# Altium schematic sheet Autoprog.SchDoc
size A4; SheetNumber: 2; SheetTotal: 2
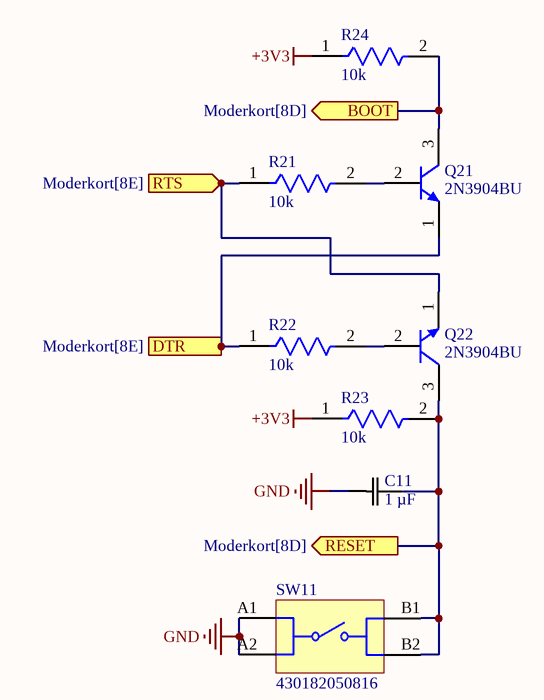
[diagram p0: Autoprog.SchDoc]

## Parts
C11  1 µF  [1 µF]
Q21  2N3904BU  [FAIR-TO-92]
Q22  2N3904BU  [FAIR-TO-92]
R21  value 10k  [FP-RT1206-IPC_C]  (hidden comment: RT1206BRD07470RL)
R22  value 10k  [FP-RT1206-IPC_C]  (hidden comment: RT1206BRD07470RL)
R23  value 10k  [FP-RT1206-IPC_C]  (hidden comment: RT1206BRD07470RL)
R24  value 10k  [FP-RT1206-IPC_C]  (hidden comment: RT1206BRD07470RL)
SW11  430182050816  [430182050816]

## Ports
BOOT (out, see Moderkort[8D]), DTR (in, see Moderkort[8E]), RESET (out, see Moderkort[8D]), RTS (in, see Moderkort[8E])

## Nets
+3V3: R23.1 R24.1
GND: C11.1 SW11.A1 SW11.A2
BOOT: Q21.3(C) R24.2 ; port BOOT
DTR: Q21.1(E) R22.1 ; port DTR
RESET: C11.2 Q22.3(C) R23.2 SW11.B1 SW11.B2 ; port RESET
RTS: Q22.1(E) R21.1 ; port RTS
NetQ21_2: Q21.2(B) R21.2
NetQ22_2: Q22.2(B) R22.2

## Library data of the parts
C11 = CMP-001-00197-1: SMD Auto X7R Flex, Ceramic, 1 uF, 20%, 25 VDC, X7R, SMD, MLCC, FT-CAP, Automotive Grade, 1206; Manufacturer_Name: Kemet; Manufacturer_Part_Number: C1206X105M3RACAUTO; Pins: 2; Copyright: Copyright (C) 2025 Ultra Librarian. All rights reserved.; Component Type: Standard; Design Item ID: 1 µF; Source: 1MicroF.SchLib
Q21 Q22 = CMP-2000-04944-1: NPN General-Purpose Amplifier, 40 V VCEO, 0.2 A, -55 to 150 degC, 2-Pin TO-92, RoHS, Bulk; Manufacturer: FairchildSemiconductor; Maximum Collector Base Voltage: 60V; Minimum DC Current Gain: 40@0.1mA@1V; Maximum Collector Emitter Voltage: 40V; Maximum DC Collector Current: 0.2A; Rad Hard: No; Maximum Operating Frequency: 300(Min)MHz; Maximum Collector Emitter Saturation Voltage: 0.2@1mA@10mA; Maximum Power Dissipation: 625mW; Package Description: 3-Pin Transistor Outline Package, Body Dia 4.79 mm, Pitch 1.27 mm; Package Reference: TO-92; Pin Count: 3; Operating Temperature: -55to150degC; Category: GPBJT; Manufacturer URL: https://www.fairchildsemi.com/; Datasheet URL: https://datasheet.ciiva.com/4722/2n3904-82270-4722369.pdf; Package: 3TO-92; Packaging: Bulk; Type: NPN; Datasheet Version: Rev. 1.1.0, 10/2014; Mounting: ThroughHole
R21-R24 = CMP-009-00218-1: Fixed Resistor, Thin Film, 0.25W, 470ohm, 200V, 0.1% +/-Tol, 25ppm/Cel, Surface Mount, 1206; Power: 250mW; Additional Feature: HIGH PRECISION; Rated Temperature: 70°C; Package Width: 1.6mm; Temperature Coefficient (ppm/Cel): 25; Package Length: 3.1mm; Package Height: 0.55mm; Construction: Chip; Termination: Wraparound; Pins: 2; Case/Package: 1206; Resistor Type: FIXED RESISTOR; Reach SVHC Compliant: Yes; Tolerance: 0.1%; Technology: THIN FILM; Mounting Technology: Surface Mount; Packaging: Tape and Reel; RoHS Compliant: Yes; Working Voltage: 200V; Min Operating Temperature: -55°C; Max Operating Temperature: 155°C
SW11 = CMP-1452-00014-10: Switch Tactile N.O. SPST Round Button Gull Wing 0.05A 12VDC 1000000Cycles 1.57N SMD Reel; Life (Cycles): 1Mcycles; Contact Resistance: 100mΩ; Actuator Length: 1.6mm; Switch Function: Off-Mom; Illumination Type: Illuminated, Non-Illuminated; Voltage Rating: 12V; Current Rating: 50mA; Switch Travel: 250µm; Actuator Material: Liquid Crystal Polymer, Polymer; Min Operating Temperature: -40°C; REACH SVHC: No; Contact Plating: Silver; Packaging: Tape and Reel; Length: 6.2mm; Width: 6.2mm; Color: Black; Max Operating Temperature: 85°C; Termination: Gull Wing; Lead Free: Lead Free; Voltage Rating (DC): 12V; Throw Configuration: SPST; Mechanical Life: 1Mcycles; Contact Material: Stainless Steel, Steel; Diameter: 3.5mm; Contact Current Rating: 50mA; Mount: Surface Mount; Height: 5mm; Insulation Resistance: 100MΩ; RoHS: Compliant